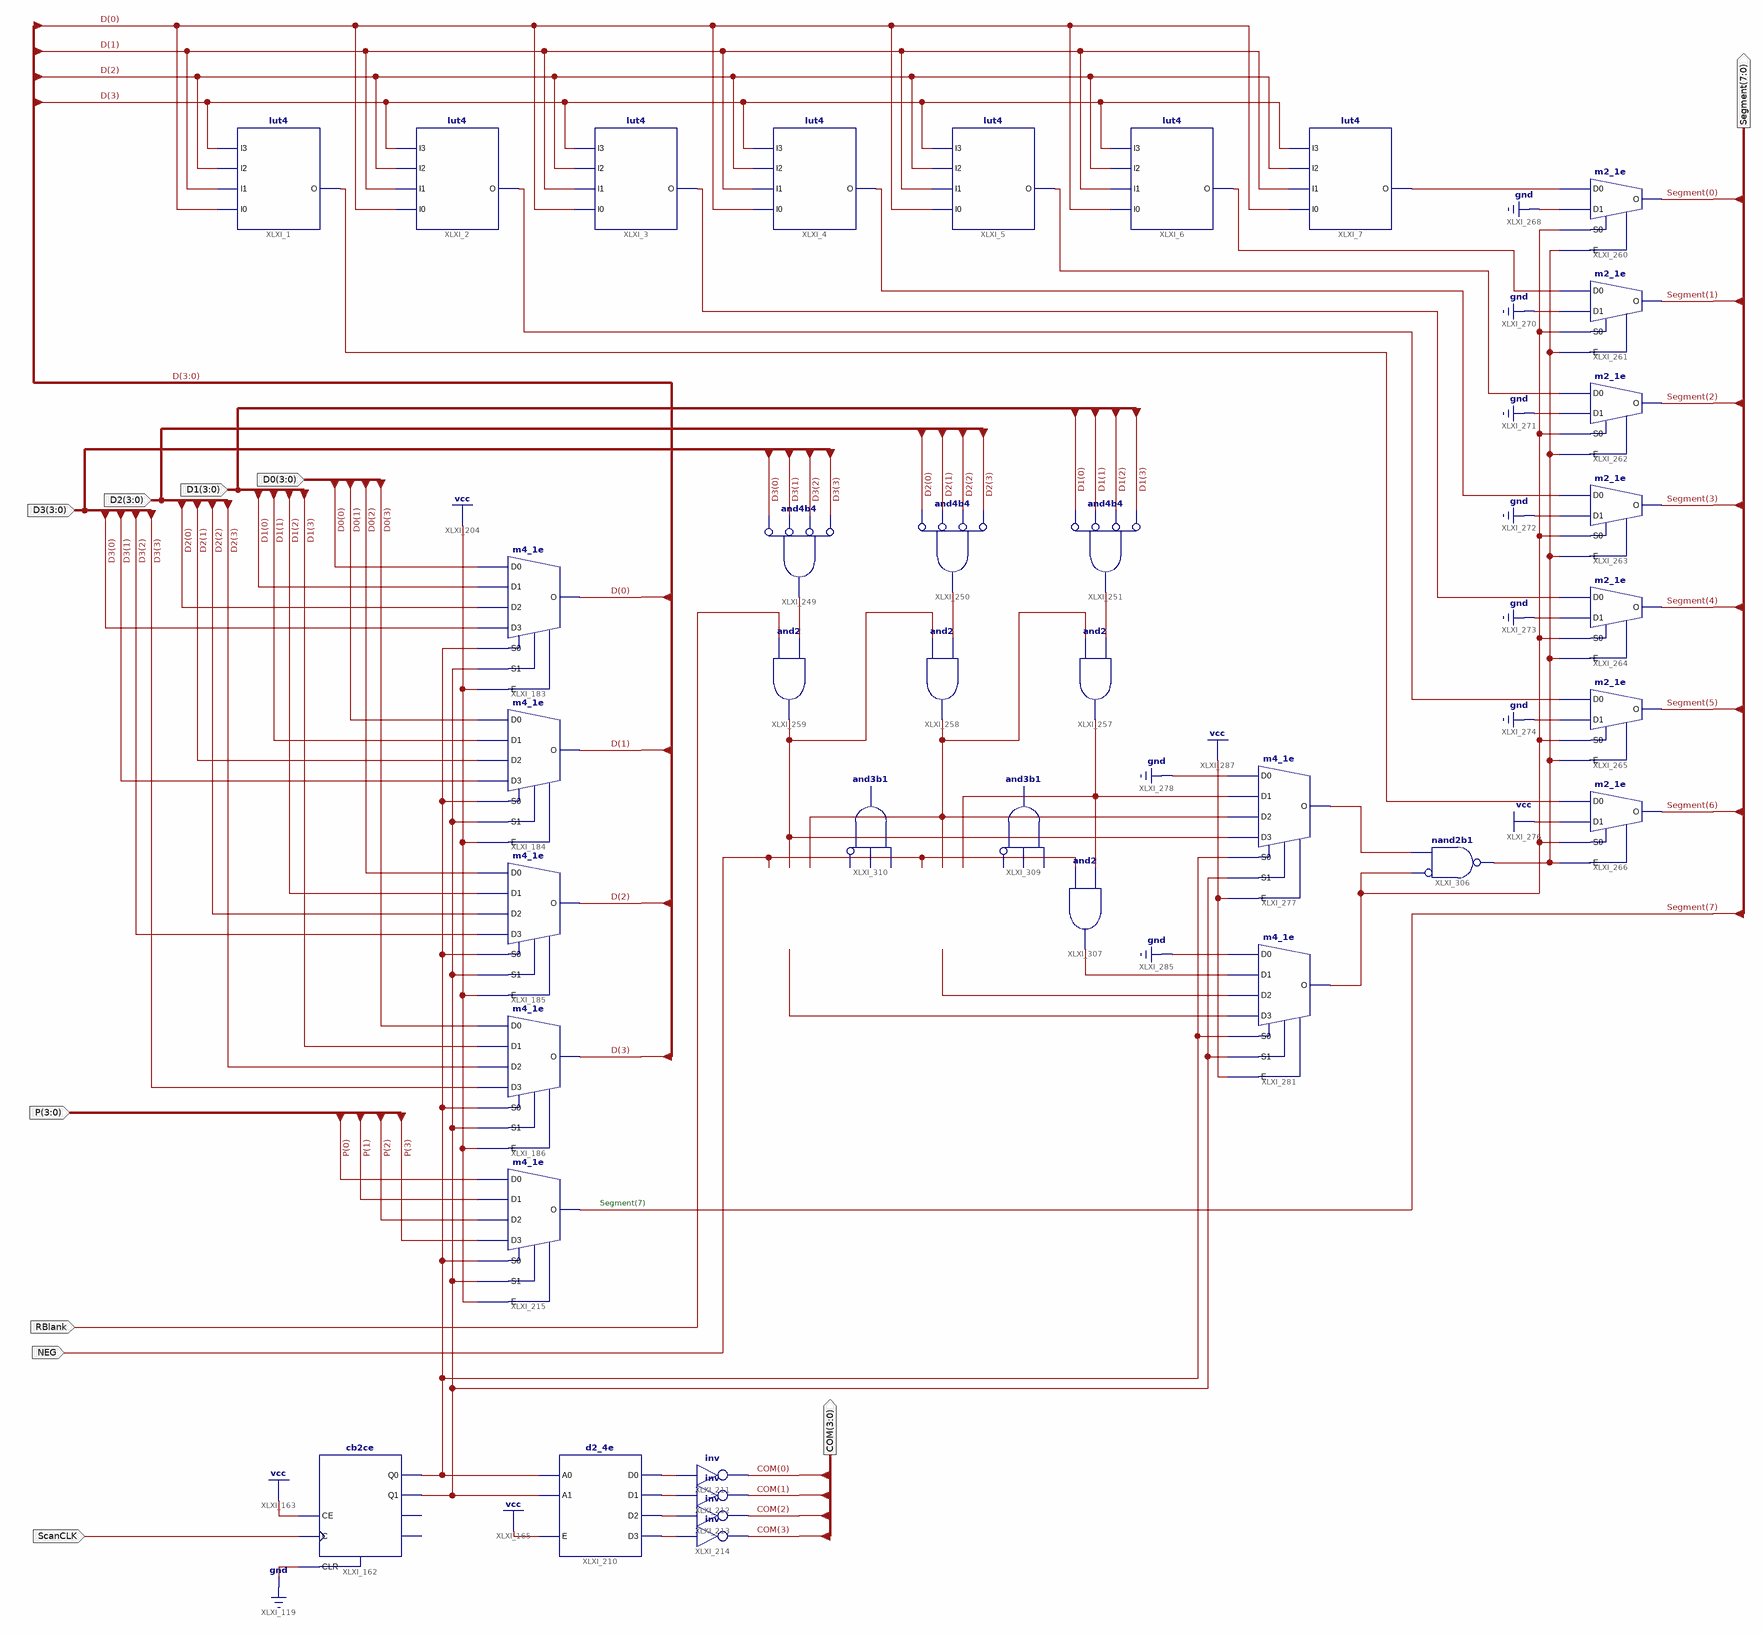
[diagram p0: schematic sheet 1]
// Xilinx ISE schematic ssd4d0ftlnpb.sch (spartan6) as structural Verilog: 37 symbols, 10 ports
module ssd4d0ftlnpb (
  input  [3:0] D0,
  input  [3:0] D1,
  input  [3:0] D2,
  input  [3:0] D3,
  input  [3:0] P,
  input  RBlank,
  input  NEG,
  input  ScanCLK,
  output [3:0] COM,
  output [7:0] Segment
);

  wire SRAW1, SRAW2, SRAW3, SRAW4, SRAW5, SRAW6, XLXN_236, XLXN_237, XLXN_238, XLXN_239, XLXN_430, XLXN_458,
       XLXN_468, XLXN_471, XLXN_487, XLXN_488, XLXN_494, XLXN_495, XLXN_544, XLXN_545, XLXN_546, XLXN_548,
       XLXN_550, XLXN_551, XLXN_552;
  wire [3:0] D;

  lut4 #(.INIT("EF7C")) XLXI_1 (.I0(D[0]), .I1(D[1]), .I2(D[2]), .I3(D[3]), .O(SRAW6));
  lut4 #(.INIT("DF71")) XLXI_2 (.I0(D[0]), .I1(D[1]), .I2(D[2]), .I3(D[3]), .O(SRAW5));
  lut4 #(.INIT("FD45")) XLXI_3 (.I0(D[0]), .I1(D[1]), .I2(D[2]), .I3(D[3]), .O(SRAW4));
  lut4 #(.INIT("7B6D")) XLXI_4 (.I0(D[0]), .I1(D[1]), .I2(D[2]), .I3(D[3]), .O(SRAW3));
  lut4 #(.INIT("2FFB")) XLXI_5 (.I0(D[0]), .I1(D[1]), .I2(D[2]), .I3(D[3]), .O(SRAW2));
  lut4 #(.INIT("279F")) XLXI_6 (.I0(D[0]), .I1(D[1]), .I2(D[2]), .I3(D[3]), .O(SRAW1));
  lut4 #(.INIT("D7ED")) XLXI_7 (.I0(D[0]), .I1(D[1]), .I2(D[2]), .I3(D[3]), .O(XLXN_430));
  m4_1e XLXI_183 (.D0(D0[0]), .D1(D1[0]), .D2(D2[0]), .D3(D3[0]), .E(1'b1), .S0(XLXN_495), .S1(XLXN_494), .O(D[0]));
  m4_1e XLXI_184 (.D0(D0[1]), .D1(D1[1]), .D2(D2[1]), .D3(D3[1]), .E(1'b1), .S0(XLXN_495), .S1(XLXN_494), .O(D[1]));
  m4_1e XLXI_185 (.D0(D0[2]), .D1(D1[2]), .D2(D2[2]), .D3(D3[2]), .E(1'b1), .S0(XLXN_495), .S1(XLXN_494), .O(D[2]));
  m4_1e XLXI_186 (.D0(D0[3]), .D1(D1[3]), .D2(D2[3]), .D3(D3[3]), .E(1'b1), .S0(XLXN_495), .S1(XLXN_494), .O(D[3]));
  m4_1e XLXI_215 (.D0(P[0]), .D1(P[1]), .D2(P[2]), .D3(P[3]), .E(1'b1), .S0(XLXN_495), .S1(XLXN_494), .O(Segment[7]));
  and XLXI_249 (XLXN_550, ~D3[0], ~D3[1], ~D3[2], ~D3[3]);  // and4b4
  and XLXI_250 (XLXN_551, ~D2[0], ~D2[1], ~D2[2], ~D2[3]);  // and4b4
  and XLXI_257 (XLXN_548, XLXN_471, XLXN_552);
  and XLXI_258 (XLXN_471, XLXN_468, XLXN_551);
  and XLXI_259 (XLXN_468, RBlank, XLXN_550);
  m2_1e XLXI_260 (.D0(XLXN_430), .D1(1'b0), .E(XLXN_487), .S0(XLXN_458), .O(Segment[0]));
  m2_1e XLXI_261 (.D0(SRAW1), .D1(1'b0), .E(XLXN_487), .S0(XLXN_458), .O(Segment[1]));
  m2_1e XLXI_262 (.D0(SRAW2), .D1(1'b0), .E(XLXN_487), .S0(XLXN_458), .O(Segment[2]));
  m2_1e XLXI_263 (.D0(SRAW3), .D1(1'b0), .E(XLXN_487), .S0(XLXN_458), .O(Segment[3]));
  m2_1e XLXI_264 (.D0(SRAW4), .D1(1'b0), .E(XLXN_487), .S0(XLXN_458), .O(Segment[4]));
  m2_1e XLXI_265 (.D0(SRAW5), .D1(1'b0), .E(XLXN_487), .S0(XLXN_458), .O(Segment[5]));
  m2_1e XLXI_266 (.D0(SRAW6), .D1(1'b1), .E(XLXN_487), .S0(XLXN_458), .O(Segment[6]));
  m4_1e XLXI_277 (
    .D0(1'b0), .D1(XLXN_548), .D2(XLXN_471), .D3(XLXN_468), .E(1'b1), .S0(XLXN_495), .S1(XLXN_494),
    .O(XLXN_488));
  m4_1e XLXI_281 (
    .D0(1'b0), .D1(XLXN_544), .D2(XLXN_545), .D3(XLXN_546), .E(1'b1), .S0(XLXN_495), .S1(XLXN_494),
    .O(XLXN_458));
  not XLXI_214 (COM[3], XLXN_239);
  not XLXI_213 (COM[2], XLXN_238);
  not XLXI_212 (COM[1], XLXN_237);
  not XLXI_211 (COM[0], XLXN_236);
  d2_4e XLXI_210 (.A0(XLXN_495), .A1(XLXN_494), .E(1'b1), .D0(XLXN_236), .D1(XLXN_237), .D2(XLXN_238), .D3(XLXN_239));
  cb2ce XLXI_162 (.C(ScanCLK), .CE(1'b1), .CLR(1'b0), .Q0(XLXN_495), .Q1(XLXN_494));  // open: CEO, TC
  nand XLXI_306 (XLXN_487, ~XLXN_458, XLXN_488);  // nand2b1
  and XLXI_307 (XLXN_544, NEG, XLXN_548);
  and XLXI_309 (XLXN_545, ~XLXN_548, XLXN_471, NEG);  // and3b1
  and XLXI_310 (XLXN_546, ~XLXN_471, XLXN_468, NEG);  // and3b1
  and XLXI_251 (XLXN_552, ~D1[0], ~D1[1], ~D1[2], ~D1[3]);  // and4b4

  // Notes on the sheet:
  //   Segment(7)
endmodule
